# Altium project Ste20W-EQ.v1.PrjPcb
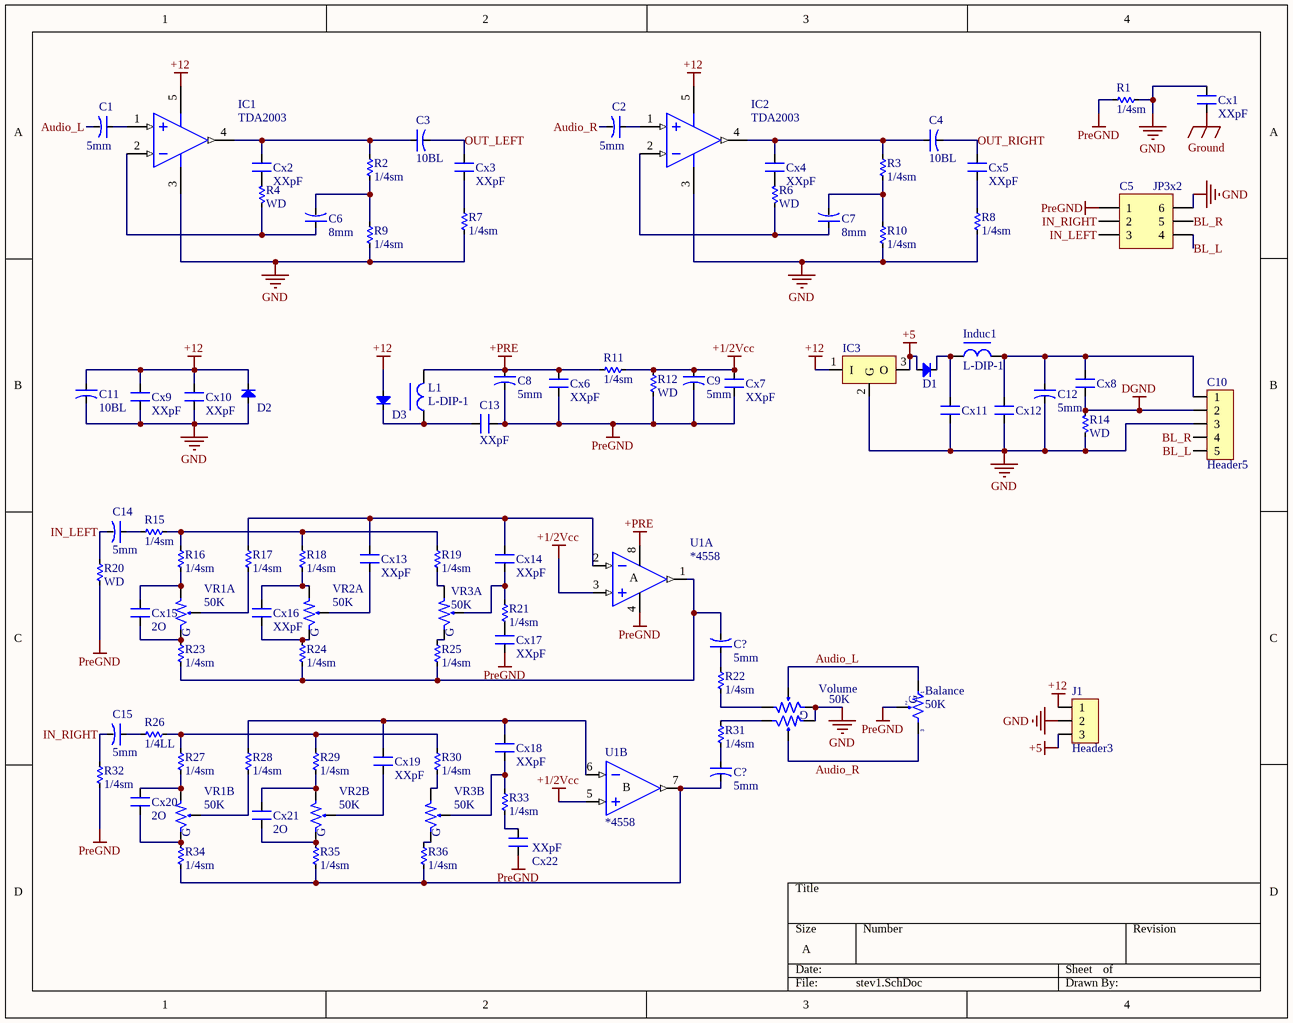
[diagram p0: stev1.SchDoc]
1 sheet, 88 parts. Net scope: global (net labels, ports and power ports of the same name join across sheets).
Board file: PCB1.PcbDoc

## Sheet stev1.SchDoc
size A; SheetNumber: 1; SheetTotal: 1

### Parts
(Parts that share a designator on the sheet are numbered #1, #2 ... from top to bottom, then left to right.)
Balance  50K  [VR-S2]
C1  5mm  [CA-ALU-5]
C2  5mm  [CA-ALU-5]
C3  10BL  [CA-ALU-10BL]
C4  10BL  [CA-ALU-10BL]
C5  JP3x2  [JP3-D2T]
C6  8mm  [CA-ALU-8]
C7  8mm  [CA-ALU-8]
C8  5mm  [CA-ALU-5]
C9  5mm  [CA-ALU-5]
C10  Header5  [Header5]
C11  10BL  [CA-ALU-10BL]
C12  5mm  [CA-ALU-5]
C13  XXpF  [CN1.5]
C14  5mm  [CA-ALU-5]
C15  5mm  [CA-ALU-5]
C?#1  5mm  [CA-ALU-5]
C?#2  5mm  [CA-ALU-5]
Cx1  XXpF  [CN1.5]
Cx2  XXpF  [CN1.5]
Cx3  XXpF  [CN1.5]
Cx4  XXpF  [CN1.5]
Cx5  XXpF  [CN1.5]
Cx6  XXpF  [CN1.5]
Cx7  XXpF  [CN1.5]
Cx8  XXpF  [CN1.5]  (value not drawn)
Cx9  XXpF  [CN1.5]
Cx10  XXpF  [CN1.5]
Cx11  XXpF  [CN1.5]  (value not drawn)
Cx12  XXpF  [CN1.5]  (value not drawn)
Cx13  XXpF  [CN1.5]
Cx14  XXpF  [CN1.5]
Cx15  2O  [CN2-O]
Cx16  XXpF  [CN1.5]
Cx17  XXpF  [CN1.5]
Cx18  XXpF  [CN1.5]
Cx19  XXpF  [CN1.5]
Cx20  2O  [CN2-O]
Cx21  2O  [CN2-O]
Cx22  XXpF  [CN1.5]
D1  Diode  [DIO-1A-SMALL]  (value not drawn)
D2  Diode  [DIO-1A-SMALL]  (value not drawn)
D3  Diode  [DIO-1A-SMALL]  (value not drawn)
IC1  TDA2003  [DIP5]
IC2  TDA2003  [DIP5]
IC3  LM78xx  [TO220H1]  (value not drawn)
Induc1  L-DIP-1  [L-DIP-M-5.3]
J1  Header3  [HDR3]
L1  L-DIP-1  [L-DIP-M-6.0]
R1  1/4sm  [RES-1/4W-SMALL]
R2  1/4sm  [RES-1/4W-SMALL]
R3  1/4sm  [RES-1/4W-SMALL]
R4  WD  [RES-1/4WD]
R6  WD  [RES-1/4WD]
R7  1/4sm  [RES-1/4W-SMALL]
R8  1/4sm  [RES-1/4W-SMALL]
R9  1/4sm  [RES-1/4W-SMALL]
R10  1/4sm  [RES-1/4W-SMALL]
R11  1/4sm  [RES-1/4W-SMALL]
R12  WD  [RES-1/4WD]
R14  WD  [RES-1/4WD]
R15  1/4sm  [RES-1/4W-SMALL]
R16  1/4sm  [RES-1/4W-SMALL]
R17  1/4sm  [RES-1/4W-SMALL]
R18  1/4sm  [RES-1/4W-SMALL]
R19  1/4sm  [RES-1/4W-SMALL]
R20  WD  [RES-1/4WD]
R21  1/4sm  [RES-1/4W-SMALL]
R22  1/4sm  [RES-1/4W-SMALL]
R23  1/4sm  [RES-1/4W-SMALL]
R24  1/4sm  [RES-1/4W-SMALL]
R25  1/4sm  [RES-1/4W-SMALL]
R26  1/4LL  [RES-1/4W]
R27  1/4sm  [RES-1/4W-SMALL]
R28  1/4sm  [RES-1/4W-SMALL]
R29  1/4sm  [RES-1/4W-SMALL]
R30  1/4sm  [RES-1/4W-SMALL]
R31  1/4sm  [RES-1/4W-SMALL]
R32  1/4sm  [RES-1/4W-SMALL]
R33  1/4sm  [RES-1/4W-SMALL]
R34  1/4sm  [RES-1/4W-SMALL]
R35  1/4sm  [RES-1/4W-SMALL]
R36  1/4sm  [RES-1/4W-SMALL]
U1  *4558  [DIP8]  (parts A,B of 2)
Volume  50K  [VR-D1]
VR1  50K  [VR-D1]  (parts A,B of 2)
VR2  50K  [VR-D1]  (parts A,B of 2)
VR3  50K  [VR-D1]  (parts A,B of 2)

### Nets
+1/2Vcc: C9.1 Cx7.2 R11.2 R12.1 U1.3(IN+) U1.5(IN+)
+5: D1.1(A) IC3.3(O) J1.3
+12: C11.1 Cx9.2 Cx10.2 D2.2(K) D3.1(A) IC1.5(V+) IC2.5(V+) IC3.1(I) J1.1
+PRE: C8.1 Cx6.2 L1.2 R11.1 U1.8(V+)
DGND: C10.2 Cx8.1 R14.2
GND: C5.6 C10.3 C11.2 C12.2 Cx1.2 Cx9.1 Cx10.1 Cx11.1 Cx12.1 D2.1(A) IC1.3(V-) IC2.3(V-) IC3.2(G) J1.2 R1.2 R7.2 R8.2 R9.2 R10.2 R14.1 Volume.1 Volume.4
Ground: Cx1.1
PreGND: Balance.2 C5.1 C8.2 C9.2 C13.1 Cx6.1 Cx7.1 Cx17.1 Cx22.1 R1.1 R12.2 R20.2 R32.1 U1.4(V-)
Audio_L: Balance.1 C1.2 Volume.2
Audio_R: Balance.3 C2.2 Volume.5
BL_L: C5.4 C10.5
BL_R: C5.5 C10.4
IN_LEFT: C5.3 C14.2 R20.1
IN_RIGHT: C5.2 C15.2 R32.2
OUT_LEFT: C3.2 Cx3.1
OUT_RIGHT: C4.2 Cx5.1
NetC1_1: C1.1 IC1.1(IN+)
NetC2_1: C2.1 IC2.1(IN+)
NetC3_1: C3.1 Cx2.2 IC1.4(OUT) R2.1
NetC4_1: C4.1 Cx4.2 IC2.4(OUT) R3.1
NetC6_1: C6.1 IC1.2(IN-) R4.1
NetC6_2: C6.2 R2.2 R9.1
NetC7_1: C7.1 IC2.2(IN-) R6.1
NetC7_2: C7.2 R3.2 R10.1
NetC10_1: C10.1 C12.1 Cx8.2 Cx12.2 Induc1.2
NetC13_2: C13.2 D3.2(K) L1.1
NetC14_1: C14.1 R15.1
NetC15_1: C15.1 R26.2
NetC?#1_1: C?#1.1 R22.2
NetC?#1_2: C?#1.2 R23.1 R24.1 R25.1 U1.1(OUT)
NetC?#2_1: C?#2.1 R31.1
NetC?#2_2: C?#2.2 R34.1 R35.1 R36.1 U1.7(OUT)
NetCx2_1: Cx2.1 R4.2
NetCx3_2: Cx3.2 R7.1
NetCx4_1: Cx4.1 R6.2
NetCx5_2: Cx5.2 R8.1
NetCx11_2: Cx11.2 D1.2(K) Induc1.1
NetCx13_1: Cx13.1 VR2.2
NetCx13_2: Cx13.2 Cx14.2 R17.1 U1.2(IN-)
NetCx14_1: Cx14.1 R21.2 VR3.2
NetCx15_1: Cx15.1 R23.2 VR1.1
NetCx15_2: Cx15.2 R16.1 VR1.3
NetCx16_1: Cx16.1 R24.2 VR2.1
NetCx16_2: Cx16.2 R18.1 VR2.3
NetCx17_2: Cx17.2 R21.1
NetCx18_1: Cx18.1 R33.2 VR3.5
NetCx18_2: Cx18.2 Cx19.2 R28.1 U1.6(IN-)
NetCx19_1: Cx19.1 VR2.5
NetCx20_1: Cx20.1 R34.2 VR1.4
NetCx20_2: Cx20.2 R27.1 VR1.6
NetCx21_1: Cx21.1 R35.2 VR2.4
NetCx21_2: Cx21.2 R29.1 VR2.6
NetCx22_2: Cx22.2 R33.1
NetR15_2: R15.2 R16.2 R18.2 R19.2
NetR17_2: R17.2 VR1.2
NetR19_1: R19.1 VR3.3
NetR22_1: R22.1 Volume.3
NetR25_2: R25.2 VR3.1
NetR26_1: R26.1 R27.2 R29.2 R30.2
NetR28_2: R28.2 VR1.5
NetR30_1: R30.1 VR3.6
NetR31_2: R31.2 Volume.6
NetR36_2: R36.2 VR3.4

### Notes on the sheet
- (in symbol 4558, part A) A
- (in symbol 4558, part B) B
- (in symbol VR-DN) G
- (in symbol VR-DPN, part A) G
- (in symbol VR-DPN, part B) G
- (in symbol VR-S) G

### Library data of the parts
Balance = VR-S: Var Resistor; Value: Volume 50k
C1-C4 C6-C9 C11 C12 C14 C15 C?#1 C?#2 = CN-ALU-DIP: Capacitor (Semiconductor SIM Model); Value: 104; LatestRevisionDate: 17-Jul-2002; LatestRevisionNote: Re-released for DXP Platform.; PackageReference: C1206; Publisher: Altium Limited
C5 = JP3x2: WR-PHD 2.54 mm Dual Socket Header; Manufacturer: W¨¹rth Elektronik eiSos GmbH; partNo: 61300621821; ComponentLink1 Description: Manufacturer; ComponentLink2 Description: Datasheet; NoPins: 06; Created Date: 29 March 2013; ComponentLink1URL: http://www.we-online.com; ComponentLink2URL: http://katalog.we-online.de/em/datasheet/6130xx21821.pdf; Created by: Karrer Zheng
C10 = Header5: Header IDC, 5 x 1 Pin Vertical 2.54mm Pitch (Non-Boxed, Male); Manufacturer: W¨¹rth Elektronik eiSos GmbH; partNo: 613002143121; ComponentLink1 Description: Manufacturer; ComponentLink2 Description: Datasheet; NoPins: 02; Created Date: 29 March 2013; ComponentLink1URL: http://www.we-online.com; ComponentLink2URL: http://katalog.we-online.de/em/datasheet/6130xx143121.pdf; Created by: Karrer Zheng
C13 Cx1-Cx22 = CN: Value: 33pF
D1-D3 = Diode: Default Diode; Code - JEDEC: DO-214-AB; Value: 1N5007; Published: 8-Jun-2000; Revision: July-2002: Re-released for DXP Platform.; Publisher: Altium Limited
IC1 IC2 = TDA2003: 10W CAR RADIO AUDIO AMPLIFIER; Value: TDA2003
IC3 = LM78xx: Positive Voltage Regulator; Note: Tab is connected to pin 3 (GND).; Published: 24-Aug-2001; LatestRevisionDate: 17-Jul-2002; LatestRevisionNote: Re-released for DXP Platform.; DatasheetVersion: Apr-1994; PackageVersion: Jul-1998; PackageReference: ISOWATT220AB; Publisher: Altium Limited; PackageDescription: TO, Thru-Hole, Vertical, Heatsink Mounted; 3 In-Line Leads; Pitch 2.54 mm; Pin sequence 1, 3, 2; ComponentLink1Description: Manufacturer Link; ComponentLink1URL: http://www.st.com/; ComponentLink2Description: Datasheet; ComponentLink2URL: http://www.st.com/stonline/products/literature/ds/2146/l78m05c.pdf
Induc1 L1 = L-DIP-1: Inductor; Value: 150 mH
J1 = Header3: Header IDC, 3 x 1 Pin Vertical 2.54mm Pitch (Non-Boxed, Male); Manufacturer: W¨¹rth Elektronik eiSos GmbH; partNo: 613002143121; ComponentLink1 Description: Manufacturer; ComponentLink2 Description: Datasheet; NoPins: 02; Created Date: 29 March 2013; ComponentLink1URL: http://www.we-online.com; ComponentLink2URL: http://katalog.we-online.de/em/datasheet/6130xx143121.pdf; Created by: Karrer Zheng
R1-R4 R6-R12 R14-R36 = Res: Manufacturer: Generic Components; Class: Passive; SubClass: R; Published: 08/06/2000; Publisher: Altium Hobart Technology Centre
U1 = 4558
Volume = VR-DN: Volume control Dual; Value: Volume Dual 50K
VR1-VR3 = VR-DPN: Volume control Dual; Value: Volume Dual 50K